# Altium schematic sheet 2_MG32F003_TSSOP20.SchDoc
size 330 x 228 mm
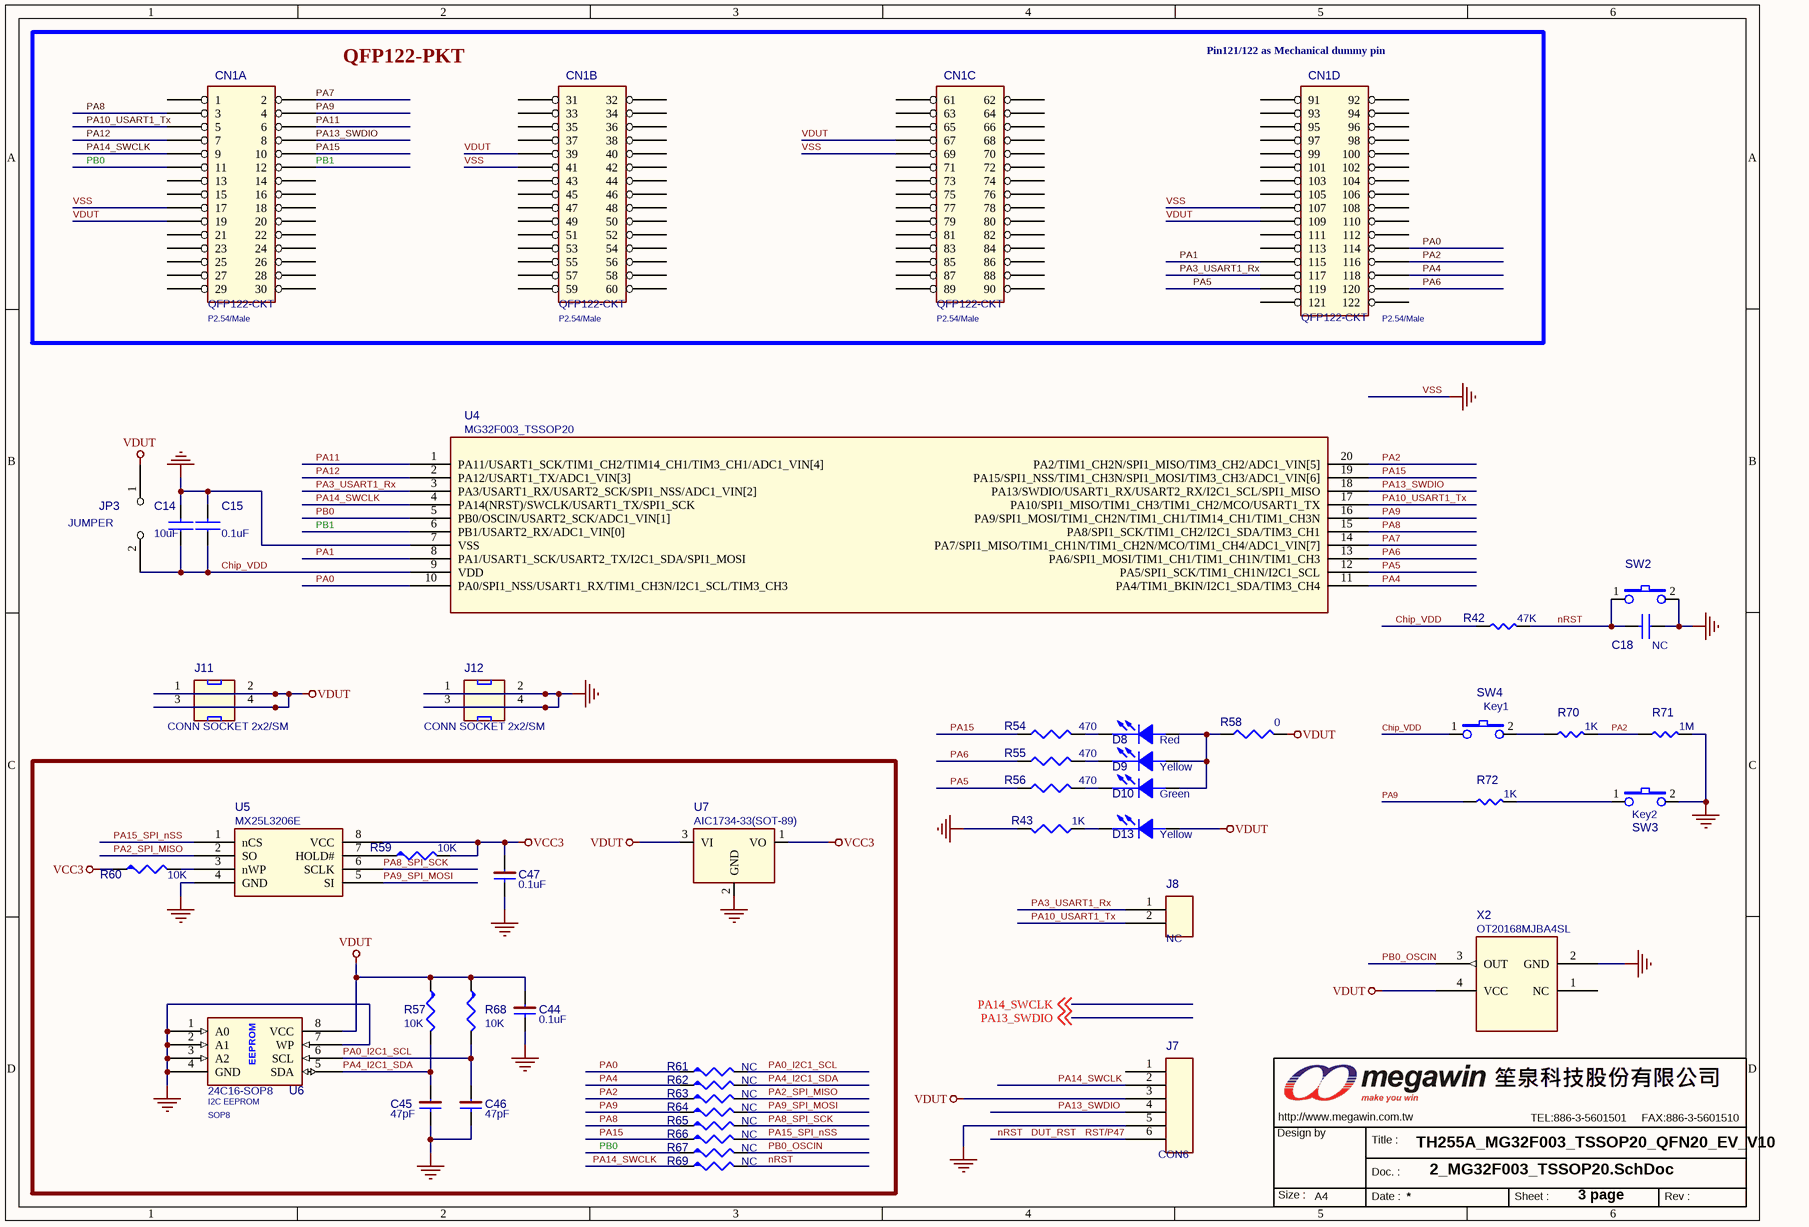
[diagram p0: 2_MG32F003_TSSOP20.SchDoc]

## Parts
C14  10uF  [C-0603]
C15  0.1uF  [C-0603]
C18  NC  [C-0603]
C44  0.1uF  [C-0603]
C45  47pF  [C-0603]
C46  47pF  [C-0603]
C47  0.1uF  [C-0603]
CN1  QFP122-CKT  Package: P2.54/Male  [QFP122-P2.54-CKT]  (parts A,B,C,D of 4)
D8  Red  [0805D]
D9  Yellow  [0805D]
D10  Green  [0805D]
D13  Yellow  [0805D]
J7  CON6  [PS6P254]
J8  NC  [PS2P254]
J11  CONN SOCKET 2x2/SM  [PS2X2P254]
J12  CONN SOCKET 2x2/SM  [PS2X2P254]
JP3  JUMPER  [PS2P254]
MW1  OrgAddr3: TEL:886-3-5601501     FAX:886-3-5601510  [MEGAWIN_3.4]  (hidden comment: MW-A4)  (graphical)
R42  47K  [R-0603]
R43  1K  [R-0603]
R54  470  [R-0603]
R55  470  [R-0603]
R56  470  [R-0603]
R57  10K  [R-0603]
R58  0  [R-0603]
R59  10K  [R-0603]
R60  10K  [R-0603]
R61  NC  [R-0603]
R62  NC  [R-0603]
R63  NC  [R-0603]
R64  NC  [R-0603]
R65  NC  [R-0603]
R66  NC  [R-0603]
R67  NC  [R-0603]
R68  10K  [R-0603]
R69  NC  [R-0603]
R70  1K  [R-0603]
R71  1M  [R-0603]
R72  1K  [R-0603]
SW2  SW TACT-SPST  [SW_T_2P]  (value not drawn)
SW3  Key2  [SW_T_2P]
SW4  Key1  [SW_T_2P]
U4  MG32F003_TSSOP20  [TSSOP20_170P065]
U5  MX25L3206E  [SO8_208P127]
U6  24C16-SOP8  Function: I2C EEPROM  Package: SOP8  [SO8_150P127]
U7  AIC1734-33(SOT-89)  [SOT89]
X2  OT20168MJBA4SL  [OSC_2.0X1.6_SMD]

## Blocks framed on the sheet
QFP122-PKT: CN1

## Nets
VCC3: C47.1 R59.2 R60.1 U5.8(VCC) U7.1(VO)
VDUT: C44.1 CN1.19 CN1.39 CN1.67 CN1.109 D13.1(ANODE) J7.3 J11.1 J11.2 J11.3 J11.4 JP3.1 R57.1 R58.2 R68.1 U6.8(VCC) U7.3(VI) X2.4(VCC)
VSS: C14.2 C15.2 C18.1 C44.2 C45.2 C46.2 C47.2 CN1.17 CN1.41 CN1.69 CN1.107 J7.5 J12.1 J12.2 J12.3 J12.4 R43.1 R71.2 SW2.2 SW3.2 U4.7(VSS) U5.4(GND) U6.1(A0) U6.2(A1) U6.3(A2) U6.4(GND) U6.7(WP) U7.2(GND) X2.2(GND)  [also labelled GND_POWER]
Chip_VDD: C14.1 C15.1 JP3.2 R42.1 SW4.1 U4.9(VDD)
DUT_RST: C18.2 J7.6 R42.2 R69.2 SW2.1  [also labelled nRST, RST/P47]
PA0: CN1.114 R61.1 U4.10(PA0/SPI1_NSS/USART1_RX/TIM1_CH3N/I2C1_SCL/TIM3_CH3)
PA0_I2C1_SCL: C46.1 R61.2 R68.2 U6.6(SCL)
PA1: CN1.115 U4.8(PA1/USART1_SCK/USART2_TX/I2C1_SDA/SPI1_MOSI)
PA2: CN1.116 R63.1 R70.2 R71.1 U4.20(PA2/TIM1_CH2N/SPI1_MISO/TIM3_CH2/ADC1_VIN[5])
PA2_SPI_MISO: R63.2 U5.2(SO)
PA3_USART1_Rx: CN1.117 J8.1 U4.3(PA3/USART1_RX/USART2_SCK/SPI1_NSS/ADC1_VIN[2])
PA4: CN1.118 R62.1 U4.11(PA4/TIM1_BKIN/I2C1_SDA/TIM3_CH4)
PA4_I2C1_SDA: C45.1 R57.2 R62.2 U6.5(SDA)
PA5: CN1.119 R56.1 U4.12(PA5/SPI1_SCK/TIM1_CH1N/I2C1_SCL)
PA6: CN1.120 R55.1 U4.13(PA6/SPI1_MOSI/TIM1_CH1/TIM1_CH1N/TIM1_CH3)
PA7: CN1.2 U4.14(PA7/SPI1_MISO/TIM1_CH1N/TIM1_CH2N/MCO/TIM1_CH4/ADC1_VIN[7])
PA8: CN1.3 R65.1 U4.15(PA8/SPI1_SCK/TIM1_CH2/I2C1_SDA/TIM3_CH1)
PA8_SPI_SCK: R65.2 U5.6(SCLK)
PA9: CN1.4 R64.1 R72.1 U4.16(PA9/SPI1_MOSI/TIM1_CH2N/TIM1_CH1/TIM14_CH1/TIM1_CH3N)
PA9_SPI_MOSI: R64.2 U5.5(SI)
PA10_USART1_Tx: CN1.5 J8.2 U4.17(PA10/SPI1_MISO/TIM1_CH3/TIM1_CH2/MCO/USART1_TX)
PA11: CN1.6 U4.1(PA11/USART1_SCK/TIM1_CH2/TIM14_CH1/TIM3_CH1/ADC1_VIN[4])
PA12: CN1.7 U4.2(PA12/USART1_TX/ADC1_VIN[3])
PA13_SWDIO: CN1.8 J7.4 U4.18(PA13/SWDIO/USART1_RX/USART2_RX/I2C1_SCL/SPI1_MISO) ; off-sheet PA13_SWDIO
PA14_SWCLK: CN1.9 J7.2 R69.1 U4.4(PA14(NRST)/SWCLK/USART1_TX/SPI1_SCK) ; off-sheet PA14_SWCLK
PA15: CN1.10 R54.1 R66.1 U4.19(PA15/SPI1_NSS/TIM1_CH3N/SPI1_MOSI/TIM3_CH3/ADC1_VIN[6])
PA15_SPI_nSS: R66.2 U5.1(nCS)
PB0: CN1.11 R67.1 U4.5(PB0/OSCIN/USART2_SCK/ADC1_VIN[1])
PB0_OSCIN: R67.2 X2.3(OUT)
PB1: CN1.12 U4.6(PB1/USART2_RX/ADC1_VIN[0])
NetD8_1: D8.1(ANODE) D9.1(ANODE) D10.1(ANODE) R58.1
NetD8_2: D8.2(CATHODE) R54.2
NetD9_2: D9.2(CATHODE) R55.2
NetD10_2: D10.2(CATHODE) R56.2
NetD13_2: D13.2(CATHODE) R43.2
NetR59_1: R59.1 U5.7(HOLD#)
NetR60_2: R60.2 U5.3(nWP)
NetR70_1: R70.1 SW4.2
NetR72_2: R72.2 SW3.1

Not connected (* = marked no-connect by the designer): CN1 1 13 14 15 16 18 20 21 22 23 24 25 26 27 28 29 30 31 32 33 34 35 36 37 38 40 42 43 44 45 46 47 48 49 50 51 52 53 54 55 56 57 58 59 60 61 62 63 64 65 66 68 70 71 72 73 74 75 76 77 78 79 80 81 82 83 84 85 86 87 88 89 90 91 92 93 94 95 96 97 98 99 100 101 102 103 104 105 106 108 110 111 112 113 121 122; J7 1; X2 1(NC)

## Notes on the sheet
- (near CN1) Pin121/122 as Mechanical dummy pin
- TH255A_MG32F003_TSSOP20_QFN20_EV_V10
- 3 page
- (in symbol ICM-24CXX) EEPROM
- (in symbol MW_A4_2) Design by; Title :; Doc. :; Size :; A4; Date :; Sheet :; Rev :

## Library data of the parts
C14 C15 C18 = CAP NP_Dup1
C44 C47 = CAP-NP: 2ND PART FIELD: SMD_0805; Assembly: NC
C45 C46 = CAP-NP: Assembly: NC; Package: C0603
D8-D10 D13 = LED
J7 = CON6_Dup1
J8 = CON2
MW1 = MW_A4_2: Page Create Date: March  8, 1995; OrgAddr2: http://www.megawin.com.tw
R42 R70-R72 = R_Dup3
R43 R54-R56 R58 = R_Dup4
R57 R68 = R: 2ND PART FIELD: SMD_0805; Assembly: NC
R59-R67 R69 = R
SW3 SW4 = SW TACT-SPST
U6 = ICM-24CXX: 1ST PART FIELD: OSD Record Buffer; 2ND PART FIELD: SOP_8PIN; Assembly: NC
U7 = AIC1722-33
X2 = OSC8_0